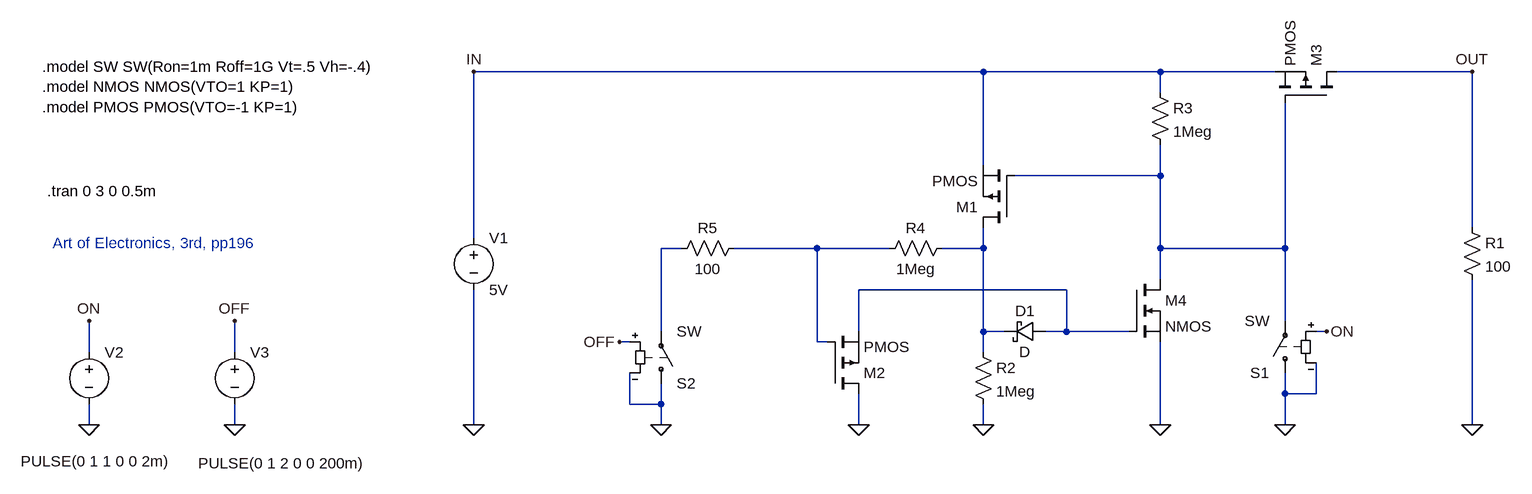
[diagram p0: schematic test_01.asc]
test_01.asc, the LTspice schematic file:
Version 4
SHEET 1 1588 680
WIRE 768 -144 -16 -144
WIRE 1040 -144 768 -144
WIRE 1216 -144 1040 -144
WIRE 1520 -144 1312 -144
WIRE 1040 -112 1040 -144
WIRE 768 0 768 -144
WIRE 1040 16 1040 -32
WIRE 1040 16 816 16
WIRE 1520 96 1520 -144
WIRE -16 112 -16 -144
WIRE 304 128 272 128
WIRE 512 128 384 128
WIRE 624 128 512 128
WIRE 768 128 768 96
WIRE 768 128 704 128
WIRE 1040 128 1040 16
WIRE 1232 128 1232 -96
WIRE 1232 128 1040 128
WIRE 1040 176 1040 128
WIRE 896 192 576 192
WIRE 1232 240 1232 128
WIRE 272 256 272 128
WIRE 576 256 576 192
WIRE 768 256 768 128
WIRE 800 256 768 256
WIRE 896 256 896 192
WIRE 896 256 864 256
WIRE 992 256 896 256
WIRE 1296 256 1280 256
WIRE 224 272 208 272
WIRE 512 272 512 128
WIRE 528 272 512 272
WIRE -608 288 -608 240
WIRE -384 288 -384 240
WIRE 768 288 768 256
WIRE 1232 352 1232 320
WIRE 1280 352 1280 304
WIRE 1280 352 1232 352
WIRE 224 368 224 320
WIRE 272 368 272 336
WIRE 272 368 224 368
WIRE -608 400 -608 368
WIRE -384 400 -384 368
WIRE -16 400 -16 192
WIRE 272 400 272 368
WIRE 576 400 576 352
WIRE 768 400 768 368
WIRE 1040 400 1040 272
WIRE 1232 400 1232 352
WIRE 1520 400 1520 176
FLAG -16 400 0
FLAG 1520 400 0
FLAG 768 400 0
FLAG 1040 400 0
FLAG 1232 400 0
FLAG 272 400 0
FLAG -608 400 0
FLAG -384 400 0
FLAG -608 240 ON
FLAG -384 240 OFF
FLAG 1520 -144 OUT
FLAG -16 -144 IN
FLAG 1296 256 ON
FLAG 208 272 OFF
FLAG 576 400 0
SYMBOL voltage -16 96 R0
SYMATTR InstName V1
SYMATTR Value 5V
SYMBOL res 1504 80 R0
SYMATTR InstName R1
SYMATTR Value 100
SYMBOL res 752 272 R0
SYMATTR InstName R2
SYMATTR Value 1Meg
SYMBOL res 1024 -128 R0
SYMATTR InstName R3
SYMATTR Value 1Meg
SYMBOL sw 1232 336 R180
SYMATTR InstName S1
SYMBOL sw 272 352 M180
SYMATTR InstName S2
SYMBOL voltage -608 272 R0
WINDOW 3 -105 184 Left 2
WINDOW 123 0 0 Left 0
WINDOW 39 0 0 Left 0
SYMATTR Value PULSE(0 1 1 0 0 2m)
SYMATTR InstName V2
SYMBOL voltage -384 272 R0
WINDOW 3 -56 187 Left 2
WINDOW 123 0 0 Left 0
WINDOW 39 0 0 Left 0
SYMATTR Value PULSE(0 1 2 0 0 200m)
SYMATTR InstName V3
SYMBOL pmos 1312 -96 M270
SYMATTR InstName M3
SYMBOL pmos 816 96 R180
SYMATTR InstName M1
SYMBOL nmos 992 176 R0
SYMATTR InstName M4
SYMBOL schottky 864 240 R90
WINDOW 0 0 32 VBottom 2
WINDOW 3 32 32 VTop 2
SYMATTR InstName D1
SYMBOL res 720 112 R90
WINDOW 0 0 56 VBottom 2
WINDOW 3 32 56 VTop 2
SYMATTR InstName R4
SYMATTR Value 1Meg
SYMBOL res 400 112 R90
WINDOW 0 0 56 VBottom 2
WINDOW 3 32 56 VTop 2
SYMATTR InstName R5
SYMATTR Value 100
SYMBOL pmos 528 352 M180
SYMATTR InstName M2
TEXT -680 -152 Left 2 !.model SW SW(Ron=1m Roff=1G Vt=.5 Vh=-.4)\n.model NMOS NMOS(VTO=1 KP=1)\n.model PMOS PMOS(VTO=-1 KP=1)
TEXT -672 40 Left 2 !.tran 0 3 0 0.5m
TEXT -664 120 Left 2 ;Art of Electronics, 3rd, pp196

The netlist it stands for:
* test_01.asc
V1 IN 0 5V
R1 OUT 0 100
R2 N004 0 1Meg
R3 IN N001 1Meg
S1 0 N001 ON 0 SW
S2 0 N002 OFF 0 SW
V2 ON 0 PULSE(0 1 1 0 0 2m)
V3 OFF 0 PULSE(0 1 2 0 0 200m)
M3 OUT N001 IN IN PMOS
M1 N004 N001 IN IN PMOS
M4 N001 N005 0 0 NMOS
D1 N005 N004 D
R4 N004 N003 1Meg
R5 N003 N002 100
M2 0 N003 N005 N005 PMOS
.model D D
.lib standard.dio
.model NMOS NMOS
.model PMOS PMOS
.lib standard.mos
.model SW SW(Ron=1m Roff=1G Vt=.5 Vh=-.4)
.model NMOS NMOS(VTO=1 KP=1)
.model PMOS PMOS(VTO=-1 KP=1)
.tran 0 3 0 0.5m
* Art of Electronics, 3rd, pp196
.backanno
.end